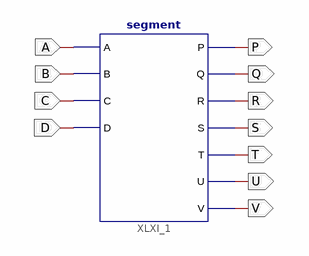
[diagram p0: schematic sheet 1]
// Xilinx ISE schematic result.sch (spartan3e) as structural Verilog: 1 symbols, 11 ports
module result (
  input  A,
  input  B,
  input  C,
  input  D,
  output P,
  output Q,
  output R,
  output S,
  output T,
  output U,
  output V
);

  segment XLXI_1 (.A(A), .B(B), .C(C), .D(D), .P(P), .Q(Q), .R(R), .S(S), .T(T), .U(U), .V(V));
endmodule
